# Altium project social.PrjPcb
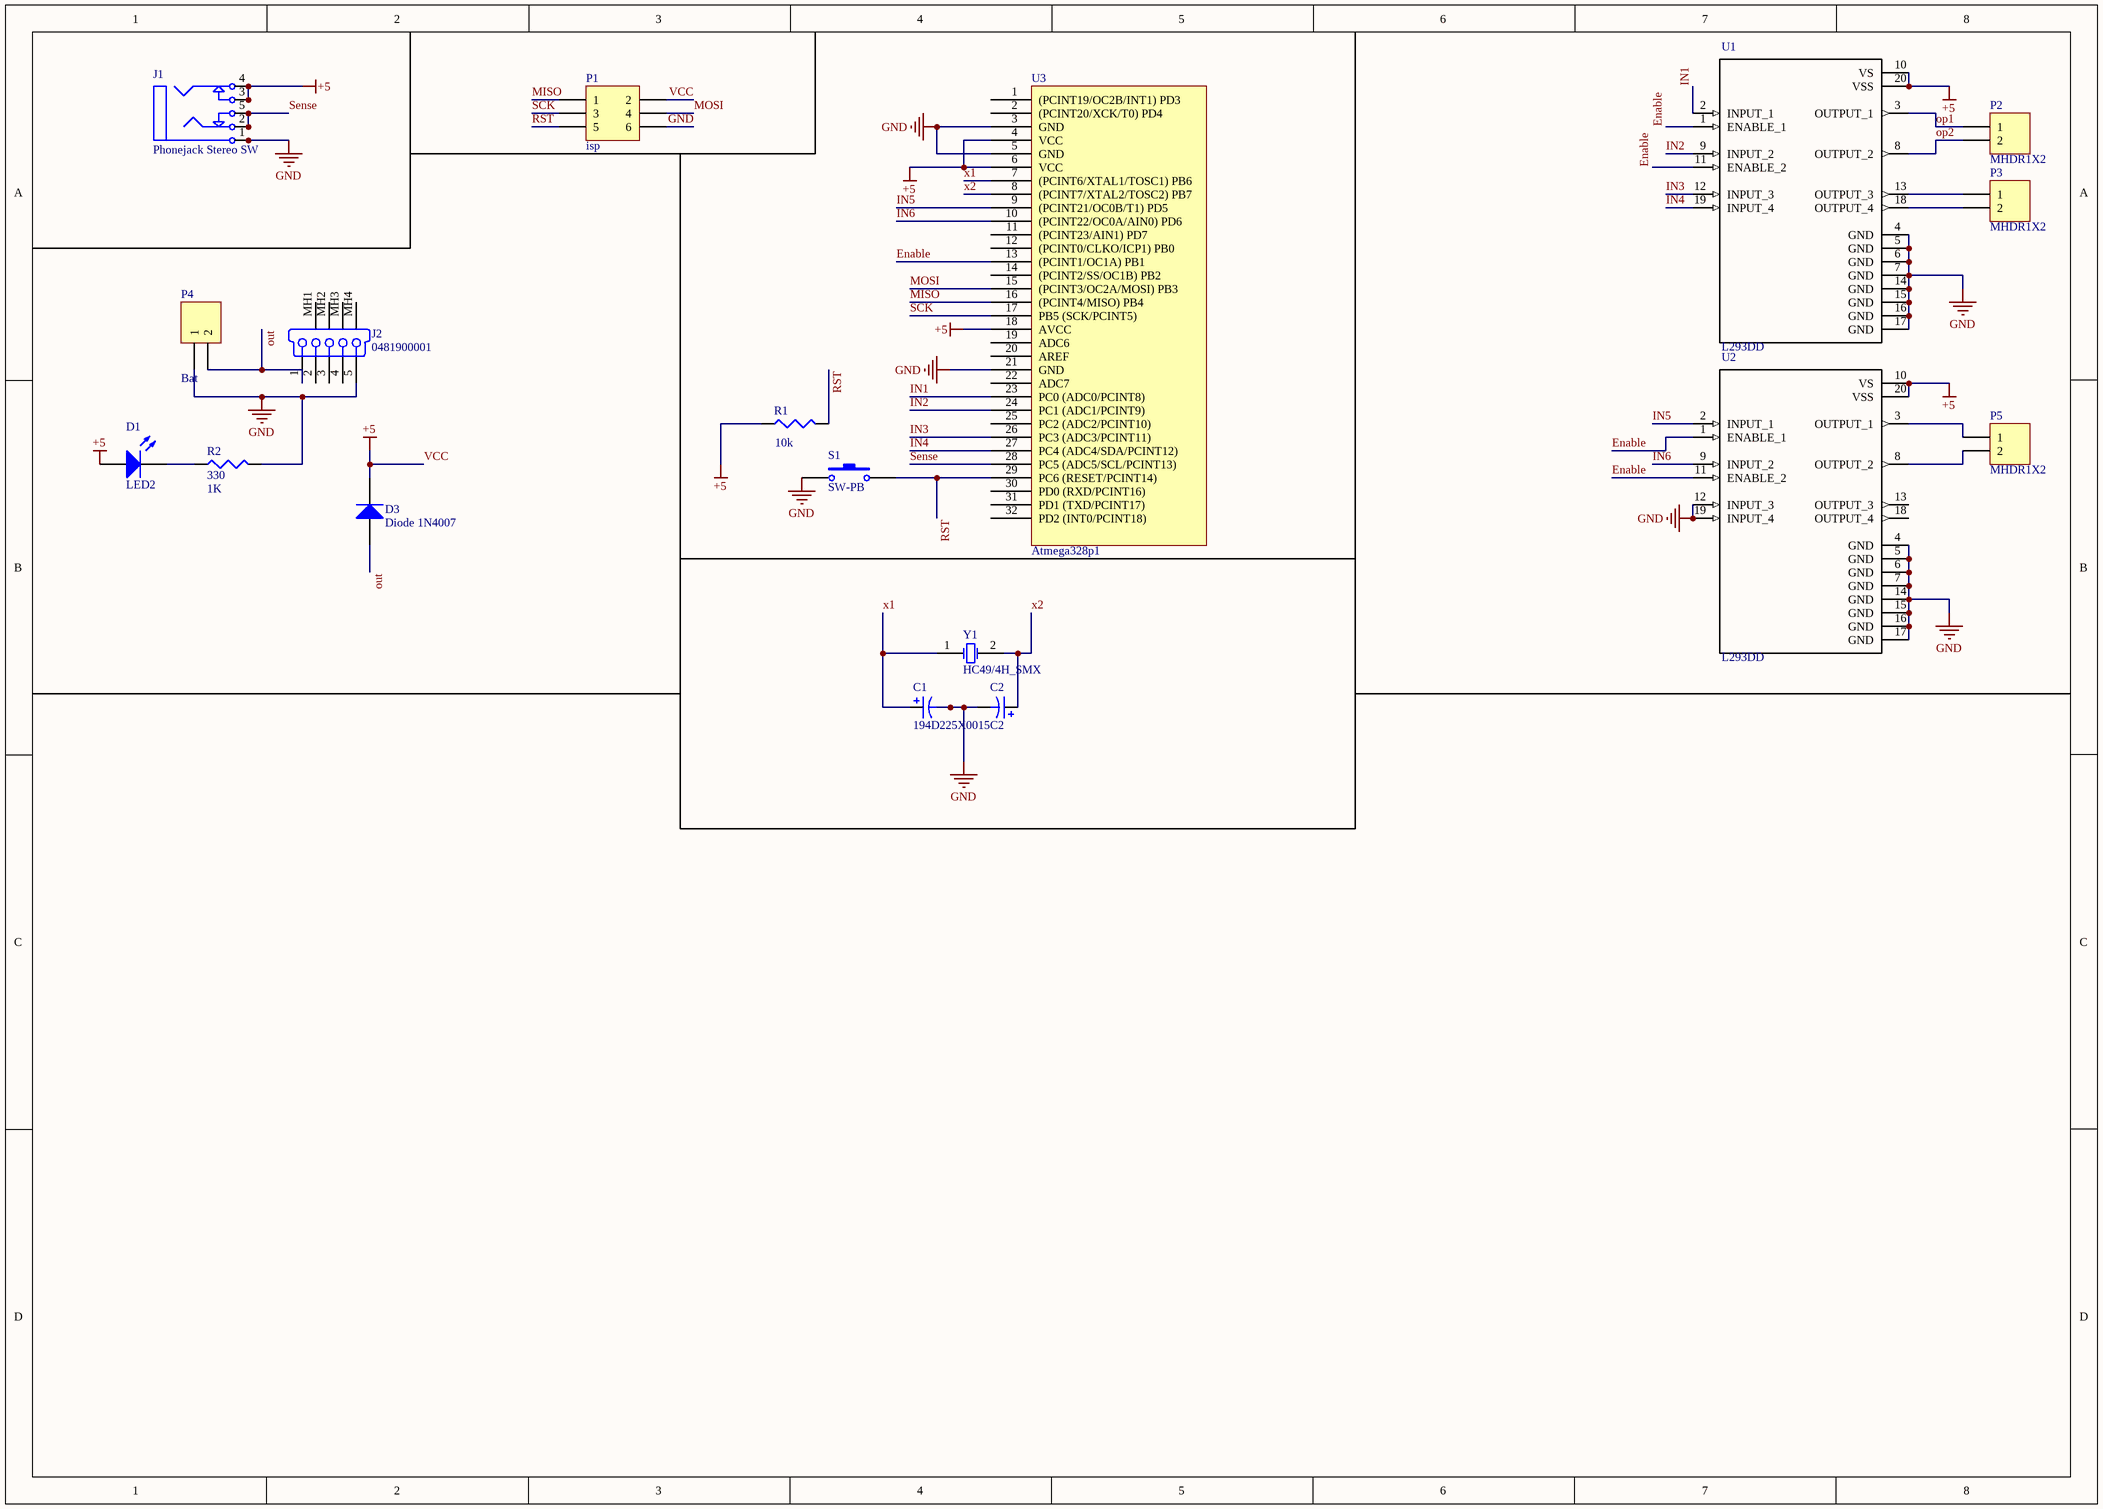
[diagram p0: Sheet1.SchDoc]
1 sheet, 18 parts. Net scope: global (net labels, ports and power ports of the same name join across sheets).
Board file: PCB1.PcbDoc

## Sheet Sheet1.SchDoc
size A3

### Parts
C1  194D225X0015C2  [C]
C2  (no value)  [C]
D1  LED2  [3.2X1.6X1.1]
D3  Diode 1N4007  [DO-41]
J1  Phonejack Stereo SW  [ST-3150-5N]
J2  0481900001  [481900001]
P1  isp  [HDR2X3]
P2  MHDR1X2  [MHDR1X2]
P3  MHDR1X2  [MHDR1X2]
P4  Bat  [MHDR1X2]
P5  MHDR1X2  [MHDR1X2]
R1  value 10k  [12Z-2010]
R2  330  value 1K  [12Z-2010]
S1  SW-PB  [SPST-2]
U1  L293DD  [*SOIC127P1032X265-20N]
U2  L293DD  [*SOIC127P1032X265-20N]
U3  Atmega328p1  [TQFP80P900X900X120-32N]
Y1  HC49/4H_SMX  [HC49/4H_SMX]

### Nets
GND: C1.2 C2.2 J1.1 J1.1A J1.1B J2.5(GND) P1.6 P4.1 R2.2 S1.1 U1.4(GND) U1.5(GND) U1.6(GND) U1.7(GND) U1.14(GND) U1.15(GND) U1.16(GND) U1.17(GND) U2.4(GND) U2.5(GND) U2.6(GND) U2.7(GND) U2.12(INPUT_3) U2.14(GND) U2.15(GND) U2.16(GND) U2.17(GND) U2.19(INPUT_4) U3.3(GND) U3.5(GND) U3.21(GND)
VCC: D1.1(A) D3.2(K) J1.3 J1.3A J1.3B J1.4 J1.4A J1.4B P1.2 R1.1 U1.10(VS) U1.20(VSS) U2.10(VS) U2.20(VSS) U3.4(VCC) U3.6(VCC) U3.18(AVCC)  [also labelled +5]
Enable: U1.1(ENABLE_1) U1.11(ENABLE_2) U2.1(ENABLE_1) U2.11(ENABLE_2) U3.13((PCINT1/OC1A)_PB1)
IN1: U1.2(INPUT_1) U3.23(PC0_(ADC0/PCINT8))
IN2: U1.9(INPUT_2) U3.24(PC1_(ADC1/PCINT9))
IN3: U1.12(INPUT_3) U3.26(PC3_(ADC3/PCINT11))
IN4: U1.19(INPUT_4) U3.27(PC4_(ADC4/SDA/PCINT12))
IN5: U2.2(INPUT_1) U3.9((PCINT21/OC0B/T1)_PD5)
IN6: U2.9(INPUT_2) U3.10((PCINT22/OC0A/AIN0)_PD6)
MISO: P1.1 U3.16((PCINT4/MISO)_PB4)
MOSI: P1.4 U3.15((PCINT3/OC2A/MOSI)_PB3)
op1: P2.1 U1.3(OUTPUT_1)
op2: P2.2 U1.8(OUTPUT_2)
out: D3.1(A) J2.1(V_BUS_(5V)) P4.2
RST: P1.5 R1.2 S1.2 U3.29(PC6_(RESET/PCINT14))
SCK: P1.3 U3.17(PB5_(SCK/PCINT5))
Sense: J1.2 J1.2A J1.2B J1.5 J1.5A J1.5B U3.28(PC5_(ADC5/SCL/PCINT13))
x1: C1.1 U3.7((PCINT6/XTAL1/TOSC1)_PB6) Y1.1(OSC1)
x2: C2.1 U3.8((PCINT7/XTAL2/TOSC2)_PB7) Y1.2(OSC2)
NetD1_2: D1.2(K) R2.1
NetP3_1: P3.1 U1.13(OUTPUT_3)
NetP3_2: P3.2 U1.18(OUTPUT_4)
NetP5_1: P5.1 U2.3(OUTPUT_1)
NetP5_2: P5.2 U2.8(OUTPUT_2)

Not connected (* = marked no-connect by the designer): J2 2(D-) 3(D+) 4(NC) MH1(Tab) MH2(Tab) MH3(Tab) MH4(Tab); U2 13(OUTPUT_3) 18(OUTPUT_4); U3 1((PCINT19/OC2B/INT1)_PD3) 2((PCINT20/XCK/T0)_PD4) 11((PCINT23/AIN1)_PD7) 12((PCINT0/CLKO/ICP1)_PB0) 14((PCINT2/SS/OC1B)_PB2) 19(ADC6) 20(AREF) 22(ADC7) 25(PC2_(ADC2/PCINT10)) 30(PD0_(RXD/PCINT16)) 31(PD1_(TXD/PCINT17)) 32(PD2_(INT0/PCINT18))

### Library data of the parts
C1 C2 = 194D225X0015C2: Midget Conformal Coated Solid Tantalum Chip Capacitor: 2.2uF, 20% Tolerance, 15 WVDC @ +85°C, Surge = 20V; Note: See Data Sheet for full range of components; Published: 19-Mar-2004; DatasheetDocument: 05-Jul-2002; PackageReference: C; Publisher: Altium Limited; ComponentLink1Description: Manufacturer Link; ComponentLink1URL: http://www.vishay.com/; ComponentLink2Description: Datasheet; ComponentLink2URL: http://www.vishay.com/docs/40000/194d.pdf; Value: 2.2uF
D1 = LED2: Typical RED, GREEN, YELLOW, AMBER GaAs LED; Published: 8-Jun-2000; LatestRevisionDate: 17-Jul-2002; LatestRevisionNote: Re-released for DXP Platform.; PackageVersion: Feb-2002; PackageReference: 3.2X1.6X1.1; Publisher: Altium Limited; PackageDescription: SM LED; 2 Flat Leads
D3 = Diode 1N4007: 1 Amp General Purpose Rectifier; Published: 8-Jun-2000; LatestRevisionDate: 17-Jul-2002; LatestRevisionNote: Re-released for DXP Platform.; DatasheetVersion: 1998; PackageVersion: Aug-1999; PackageReference: DO-41; Publisher: Altium Limited; PackageDescription: Diode, Axial; Body 5.2 x 2.7 mm (LxDia. max), Lead Dia. 0.86 mm (max); Code_JEDEC: DO-204-AL; ComponentLink1Description: Manufacturer Link; ComponentLink1URL: http://www.fairchildsemi.com/; ComponentLink2Description: Datasheet; ComponentLink2URL: http://www.fairchildsemi.com/ds/1N%2F1N4001.pdf
J1 = Phonejack Stereo SW: 3-Conductor Jack with 2 break contacts (normals) and 2 auxiliary make contacts; Published: 5-Jan-2004; LatestRevisionDate: 17-Dec-2003; LatestRevisionNote: PCB Footprint replaced.; DatasheetDocument: 07-Mar-2000; Publisher: Altium Limited; ComponentLink1Description: Manufacturer Link; ComponentLink1URL: http://domino.kycon.com/internet/Products.html
J2 = 0481900001: USB On-The-Go (OTG) Mini-B Receptacle, Right Angle, SMT, 0.80mm (.031") Pitch, Solder Tabs with Back Cover, Recessed Type; PCB_Layout: Complies with Manufacturer's Recommendation.; Published: 21-Sep-2007; DatasheetVersion: revA, May-2004; PackageVersion: May-2004; PackageReference: 481900001; Publisher: Altium Limited; PackageDescription: USB Mini-B, Sinking Type, SM; 5 Position; Right Angle, Body 11.45 x 11.8 x 3.9 mm (LxWxH); ComponentLink1Description: Manufacturer Link; ComponentLink1URL: http://www.molex.com/; ComponentLink2Description: Datasheet; ComponentLink2URL: http://www.molex.com/cmc_upload/0/000/895/958/SD-48190-001RevA.pdf
P1 = Header 3X2: Header, 3-Pin, Dual row; LatestRevisionDate: 17-Jul-2002; LatestRevisionNote: Re-released for DXP Platform.; Publisher: Altium Limited
P2-P5 = MHDR1X2: Header, 2-Pin; LatestRevisionDate: 17-Jul-2002; LatestRevisionNote: Re-released for DXP Platform.; Publisher: Altium Limited
R1 R2 = Res3: Resistor; Published: 8-Jun-2000; LatestRevisionDate: 29-May-2009; LatestRevisionNote: IPC-7351 Footprint Added.; PackageReference: J1-0603; Publisher: Altium Limited; PackageDescription: Chip Resistor
S1 = SW-PB: Switch; Published: 24-Mar-1999; LatestRevisionDate: 17-Jul-2002; LatestRevisionNote: Re-released for DXP Platform.; PackageReference: SPST-2; Publisher: Altium Limited; PackageDescription: Switch; 2 Leads
U1 U2 = L293DD: L293DD Series Push - Pull Quad Channel Driver with Diodes - SOIC-20; MF: STMicroelectronics; Package: SOIC-20 STMicroelectronics; Price: None; Availability: Unavailable; MP: L293DD; SnapEDA_Link: https://www.snapeda.com/parts/L293DD/STMicroelectronics/view-part/?ref=snap; Value: *
U3 = Atmega328p1: AVR
Y1 = HC49/4H_SMX: Surface Mount Quartz Crystal; Note: PCB layout complies with manufacturer's recommendation.; Published: 17-Jul-2002; DatasheetDocument: 18-Oct-1999; PackageDocument: 18-Oct-1999; PackageReference: HC49/4H_SMX; Publisher: Altium Limited; ComponentLink1Description: Manufacturer Link; ComponentLink1URL: http://www.cmac.com/mt/; ComponentLink2Description: Datasheet; ComponentLink2URL: http://www.cmac.com/mt/databook/crystals/smd/hc49_4h_smx.pdf